# Altium project MIXR Input and Processing.PrjPcb (part 1 of 6)
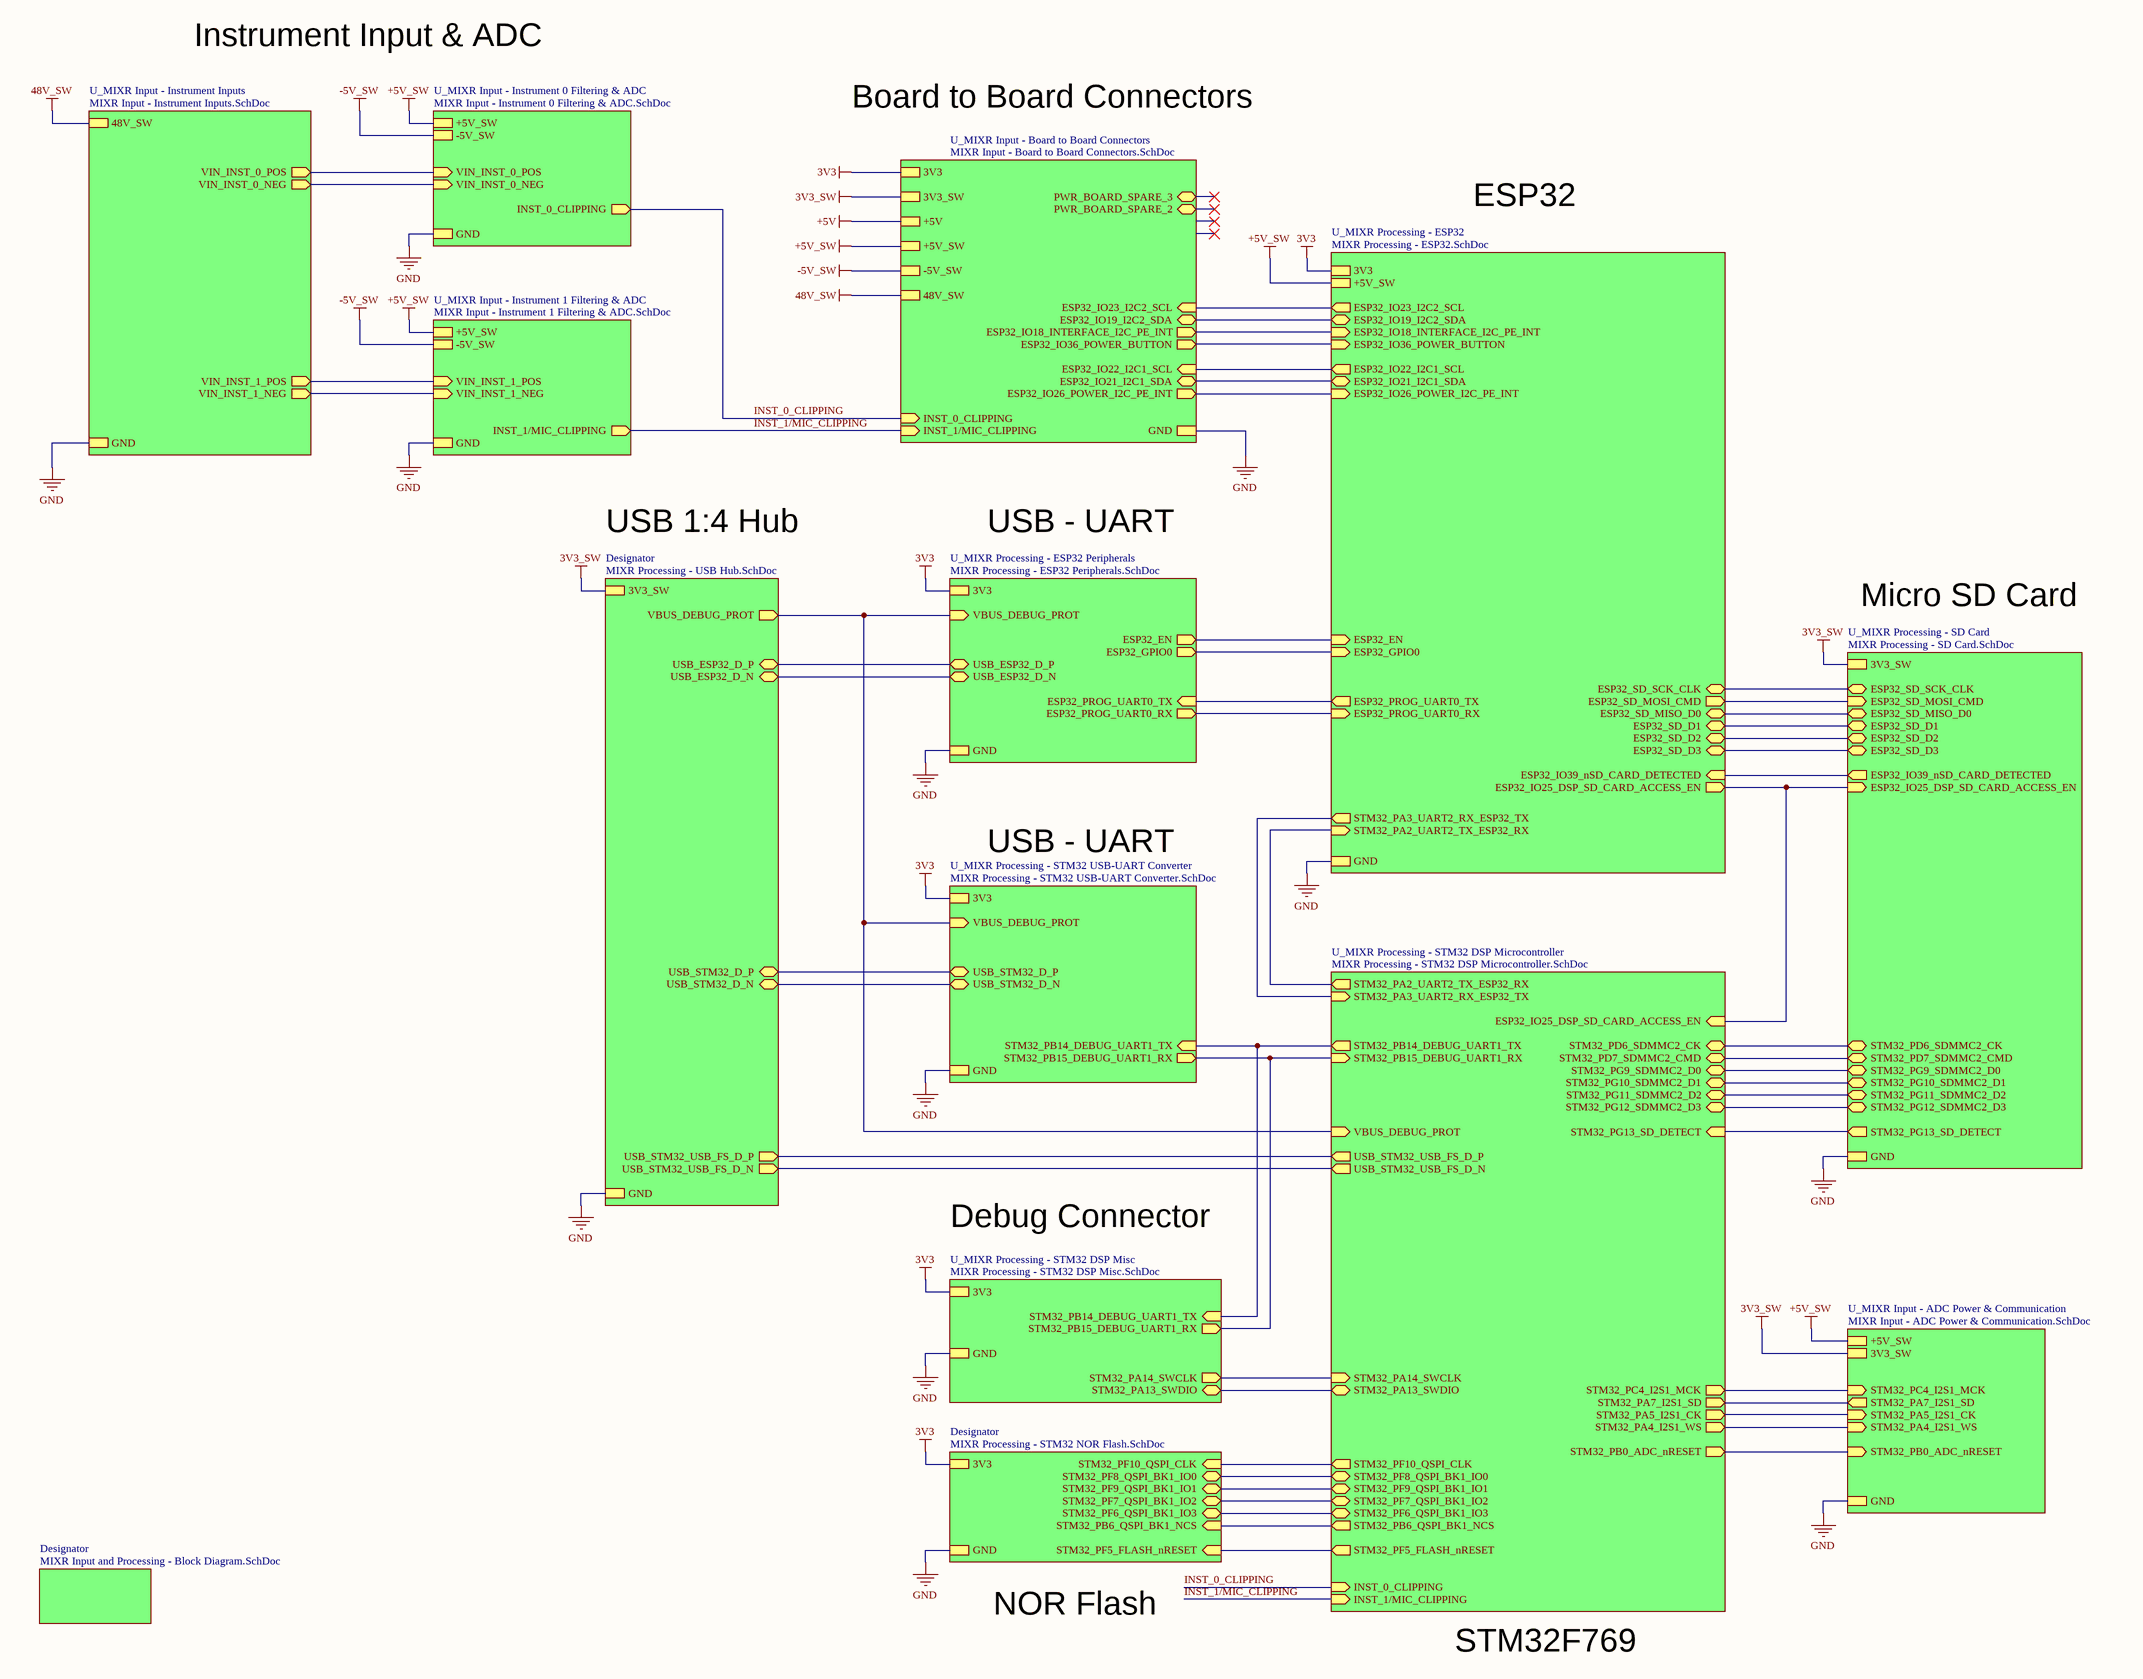
[diagram p0: Top Sheet.SchDoc]
PartNumber: MIXR-002-01; ProjectAuthor: Taiping Li; ProjectRevision: 1.0
15 sheets, 229 parts. Net scope: flat (ports and power ports of the same name join across sheets).
Board file: MIXR Input and Processing.PcbDoc
Sheets:
  Top Sheet.SchDoc
    Designator = MIXR Processing - USB Hub.SchDoc
    U_MIXR Processing - STM32 USB-UART Converter = MIXR Processing - STM32 USB-UART Converter.SchDoc
    U_MIXR Processing - STM32 DSP Microcontroller = MIXR Processing - STM32 DSP Microcontroller.SchDoc
    U_MIXR Processing - SD Card = MIXR Processing - SD Card.SchDoc
    U_MIXR Processing - ESP32 = MIXR Processing - ESP32.SchDoc
    U_MIXR Processing - ESP32 Peripherals = MIXR Processing - ESP32 Peripherals.SchDoc
    U_MIXR Input - Instrument Inputs = MIXR Input - Instrument Inputs.SchDoc
    U_MIXR Input - Instrument 1 Filtering & ADC = MIXR Input - Instrument 1 Filtering & ADC.SchDoc
    U_MIXR Input - Instrument 0 Filtering & ADC = MIXR Input - Instrument 0 Filtering & ADC.SchDoc
    U_MIXR Input - ADC Power & Communication = MIXR Input - ADC Power & Communication.SchDoc
    U_MIXR Processing - STM32 DSP Misc = MIXR Processing - STM32 DSP Misc.SchDoc
    U_MIXR Input - Board to Board Connectors = MIXR Input - Board to Board Connectors.SchDoc
    Designator = MIXR Processing - STM32 NOR Flash.SchDoc
    Designator = MIXR Input and Processing - Block Diagram.SchDoc

## Sheet Top Sheet.SchDoc: MIXR Input & Processing - Top Sheet
size C; Organization: Midnight Sun Solar Rayce Car Team; Address1: University of Waterloo; Address2: 200 University Ave W; Address3: Waterloo, ON, Canada; Address4: N2L 3E9; DocumentNumber: 2; SheetNumber: 2; SheetTotal: 15; Website: www.uwmidsun.com; ProjectName: ProjectName

### Sub-sheets
Designator = MIXR Processing - USB Hub.SchDoc: USB_STM32_D_P (bidir), USB_STM32_D_N (bidir), USB_ESP32_D_N (bidir), USB_STM32_USB_FS_D_N (out), USB_STM32_USB_FS_D_P (out), USB_ESP32_D_P (bidir), GND, VBUS_DEBUG_PROT (out), 3V3_SW
Designator = MIXR Processing - STM32 NOR Flash.SchDoc: STM32_PF6_QSPI_BK1_IO3 (bidir), STM32_PF7_QSPI_BK1_IO2 (bidir), GND, STM32_PF5_FLASH_nRESET (in), STM32_PF10_QSPI_CLK (in), 3V3, STM32_PF8_QSPI_BK1_IO0 (bidir), STM32_PF9_QSPI_BK1_IO1 (bidir), STM32_PB6_QSPI_BK1_NCS (in)
Designator = MIXR Input and Processing - Block Diagram.SchDoc: no entries
U_MIXR Input - ADC Power & Communication = MIXR Input - ADC Power & Communication.SchDoc: STM32_PC4_I2S1_MCK (in), STM32_PA7_I2S1_SD (out), STM32_PA5_I2S1_CK (in), STM32_PA4_I2S1_WS (in), +5V_SW, 3V3_SW, GND, STM32_PB0_ADC_nRESET (in)  | Name: ADC
U_MIXR Input - Board to Board Connectors = MIXR Input - Board to Board Connectors.SchDoc: GND, ESP32_IO21_I2C1_SDA (bidir), 3V3, +5V, -5V_SW, 3V3_SW, +5V_SW, 48V_SW, PWR_BOARD_SPARE_2 (bidir), PWR_BOARD_SPARE_3 (bidir), ESP32_IO22_I2C1_SCL (in), ESP32_IO26_POWER_I2C_PE_INT (out), ESP32_IO19_I2C2_SDA (bidir), ESP32_IO18_INTERFACE_I2C_PE_INT (out), ESP32_IO36_POWER_BUTTON (out), ESP32_IO23_I2C2_SCL (in), INST_1/MIC_CLIPPING (in), INST_0_CLIPPING (in)  | Name: PWR BOARD
U_MIXR Input - Instrument 0 Filtering & ADC = MIXR Input - Instrument 0 Filtering & ADC.SchDoc: VIN_INST_0_POS (in), VIN_INST_0_NEG (in), INST_0_CLIPPING (out), GND, -5V_SW, +5V_SW
U_MIXR Input - Instrument 1 Filtering & ADC = MIXR Input - Instrument 1 Filtering & ADC.SchDoc: VIN_INST_1_POS (in), VIN_INST_1_NEG (in), INST_1/MIC_CLIPPING (out), GND, -5V_SW, +5V_SW
U_MIXR Input - Instrument Inputs = MIXR Input - Instrument Inputs.SchDoc: VIN_INST_0_POS (out), VIN_INST_0_NEG (out), VIN_INST_1_POS (out), VIN_INST_1_NEG (out), 48V_SW, GND
U_MIXR Processing - ESP32 = MIXR Processing - ESP32.SchDoc: ESP32_SD_SCK_CLK (bidir), ESP32_SD_MOSI_CMD (out), ESP32_SD_MISO_D0 (bidir), ESP32_SD_D1 (bidir), ESP32_SD_D3 (bidir), ESP32_EN (in), ESP32_GPIO0 (in), ESP32_PROG_UART0_TX (out), ESP32_PROG_UART0_RX (in), ESP32_IO19_I2C2_SDA (bidir), ESP32_IO23_I2C2_SCL (out), ESP32_IO39_nSD_CARD_DETECTED (in), ESP32_IO36_POWER_BUTTON (in), ESP32_IO25_DSP_SD_CARD_ACCESS_EN (out), ESP32_IO21_I2C1_SDA (bidir), ESP32_IO22_I2C1_SCL (out), ESP32_SD_D2 (bidir), ESP32_IO26_POWER_I2C_PE_INT (in), 3V3, GND, STM32_PA2_UART2_TX_ESP32_RX (in), STM32_PA3_UART2_RX_ESP32_TX (out), ESP32_IO18_INTERFACE_I2C_PE_INT (in), +5V_SW  | Name: ESP32
U_MIXR Processing - ESP32 Peripherals = MIXR Processing - ESP32 Peripherals.SchDoc: USB_ESP32_D_P (bidir), USB_ESP32_D_N (bidir), ESP32_EN (out), ESP32_GPIO0 (out), ESP32_PROG_UART0_TX (in), ESP32_PROG_UART0_RX (out), 3V3, GND, VBUS_DEBUG_PROT (in)
U_MIXR Processing - SD Card = MIXR Processing - SD Card.SchDoc: ESP32_SD_SCK_CLK (bidir), ESP32_SD_MOSI_CMD (in), ESP32_SD_MISO_D0 (bidir), ESP32_SD_D1 (bidir), ESP32_SD_D2 (bidir), ESP32_SD_D3 (bidir), ESP32_IO39_nSD_CARD_DETECTED (out), STM32_PG11_SDMMC2_D2 (bidir), STM32_PG12_SDMMC2_D3 (bidir), STM32_PD6_SDMMC2_CK (bidir), STM32_PD7_SDMMC2_CMD (bidir), STM32_PG13_SD_DETECT (out), STM32_PG10_SDMMC2_D1 (bidir), STM32_PG9_SDMMC2_D0 (bidir), GND, 3V3_SW, ESP32_IO25_DSP_SD_CARD_ACCESS_EN (in)  | Name: SD Card
U_MIXR Processing - STM32 DSP Microcontroller = MIXR Processing - STM32 DSP Microcontroller.SchDoc: STM32_PG11_SDMMC2_D2 (bidir), STM32_PG12_SDMMC2_D3 (bidir), STM32_PG10_SDMMC2_D1 (bidir), STM32_PG9_SDMMC2_D0 (bidir), STM32_PD6_SDMMC2_CK (bidir), STM32_PD7_SDMMC2_CMD (bidir), STM32_PC4_I2S1_MCK (out), STM32_PA7_I2S1_SD (out), STM32_PA5_I2S1_CK (out), STM32_PA4_I2S1_WS (out), STM32_PB14_DEBUG_UART1_TX (out), STM32_PB15_DEBUG_UART1_RX (in), USB_STM32_USB_FS_D_P (out), USB_STM32_USB_FS_D_N (out), STM32_PG13_SD_DETECT (in), STM32_PA14_SWCLK (in), STM32_PA13_SWDIO (bidir), VBUS_DEBUG_PROT (in), STM32_PB0_ADC_nRESET (out), STM32_PA2_UART2_TX_ESP32_RX (out), STM32_PA3_UART2_RX_ESP32_TX (in), ESP32_IO25_DSP_SD_CARD_ACCESS_EN (in), INST_0_CLIPPING (in), INST_1/MIC_CLIPPING (in), STM32_PF7_QSPI_BK1_IO2 (bidir), STM32_PF8_QSPI_BK1_IO0 (bidir), STM32_PF6_QSPI_BK1_IO3 (bidir), STM32_PF9_QSPI_BK1_IO1 (bidir), STM32_PF10_QSPI_CLK (out), STM32_PB6_QSPI_BK1_NCS (out), STM32_PF5_FLASH_nRESET (out)
U_MIXR Processing - STM32 DSP Misc = MIXR Processing - STM32 DSP Misc.SchDoc: 3V3, STM32_PA13_SWDIO (bidir), STM32_PA14_SWCLK (out), STM32_PB15_DEBUG_UART1_RX (out), STM32_PB14_DEBUG_UART1_TX (in), GND
U_MIXR Processing - STM32 USB-UART Converter = MIXR Processing - STM32 USB-UART Converter.SchDoc: USB_STM32_D_P (bidir), USB_STM32_D_N (bidir), STM32_PB14_DEBUG_UART1_TX (in), STM32_PB15_DEBUG_UART1_RX (out), 3V3, GND, VBUS_DEBUG_PROT (in)

### Nets
3V3: sheet U_MIXR Processing - STM32 USB-UART Converter/3V3, sheet U_MIXR Processing - ESP32/3V3, sheet U_MIXR Processing - ESP32 Peripherals/3V3, sheet U_MIXR Processing - STM32 DSP Misc/3V3, sheet U_MIXR Input - Board to Board Connectors/3V3, sheet Designator/3V3
3V3_SW: sheet Designator/3V3_SW, sheet U_MIXR Processing - SD Card/3V3_SW, sheet U_MIXR Input - ADC Power & Communication/3V3_SW, sheet U_MIXR Input - Board to Board Connectors/3V3_SW
48V_SW: sheet U_MIXR Input - Instrument Inputs/48V_SW, sheet U_MIXR Input - Board to Board Connectors/48V_SW
+5V_SW: sheet U_MIXR Processing - ESP32/+5V_SW, sheet U_MIXR Input - Instrument 1 Filtering & ADC/+5V_SW, sheet U_MIXR Input - Instrument 0 Filtering & ADC/+5V_SW, sheet U_MIXR Input - ADC Power & Communication/+5V_SW, sheet U_MIXR Input - Board to Board Connectors/+5V_SW
-5V_SW: sheet U_MIXR Input - Instrument 1 Filtering & ADC/-5V_SW, sheet U_MIXR Input - Instrument 0 Filtering & ADC/-5V_SW, sheet U_MIXR Input - Board to Board Connectors/-5V_SW
GND: sheet Designator/GND, sheet U_MIXR Processing - STM32 USB-UART Converter/GND, sheet U_MIXR Processing - SD Card/GND, sheet U_MIXR Processing - ESP32/GND, sheet U_MIXR Processing - ESP32 Peripherals/GND, sheet U_MIXR Input - Instrument Inputs/GND, sheet U_MIXR Input - Instrument 1 Filtering & ADC/GND, sheet U_MIXR Input - Instrument 0 Filtering & ADC/GND, sheet U_MIXR Input - ADC Power & Communication/GND, sheet U_MIXR Processing - STM32 DSP Misc/GND, sheet U_MIXR Input - Board to Board Connectors/GND, sheet Designator/GND
INST_0_CLIPPING: sheet U_MIXR Processing - STM32 DSP Microcontroller/INST_0_CLIPPING, sheet U_MIXR Input - Instrument 0 Filtering & ADC/INST_0_CLIPPING, sheet U_MIXR Input - Board to Board Connectors/INST_0_CLIPPING
INST_1/MIC_CLIPPING: sheet U_MIXR Processing - STM32 DSP Microcontroller/INST_1/MIC_CLIPPING, sheet U_MIXR Input - Instrument 1 Filtering & ADC/INST_1/MIC_CLIPPING, sheet U_MIXR Input - Board to Board Connectors/INST_1/MIC_CLIPPING
(unnamed): sheet Designator/USB_STM32_D_P, sheet U_MIXR Processing - STM32 USB-UART Converter/USB_STM32_D_P
(unnamed): sheet Designator/USB_STM32_D_N, sheet U_MIXR Processing - STM32 USB-UART Converter/USB_STM32_D_N
(unnamed): sheet Designator/USB_ESP32_D_N, sheet U_MIXR Processing - ESP32 Peripherals/USB_ESP32_D_N
(unnamed): sheet Designator/USB_STM32_USB_FS_D_N, sheet U_MIXR Processing - STM32 DSP Microcontroller/USB_STM32_USB_FS_D_N
(unnamed): sheet Designator/USB_STM32_USB_FS_D_P, sheet U_MIXR Processing - STM32 DSP Microcontroller/USB_STM32_USB_FS_D_P
(unnamed): sheet Designator/USB_ESP32_D_P, sheet U_MIXR Processing - ESP32 Peripherals/USB_ESP32_D_P
(unnamed): sheet Designator/VBUS_DEBUG_PROT, sheet U_MIXR Processing - STM32 USB-UART Converter/VBUS_DEBUG_PROT, sheet U_MIXR Processing - STM32 DSP Microcontroller/VBUS_DEBUG_PROT, sheet U_MIXR Processing - ESP32 Peripherals/VBUS_DEBUG_PROT
(unnamed): sheet U_MIXR Processing - STM32 USB-UART Converter/STM32_PB14_DEBUG_UART1_TX, sheet U_MIXR Processing - STM32 DSP Microcontroller/STM32_PB14_DEBUG_UART1_TX, sheet U_MIXR Processing - STM32 DSP Misc/STM32_PB14_DEBUG_UART1_TX
(unnamed): sheet U_MIXR Processing - STM32 USB-UART Converter/STM32_PB15_DEBUG_UART1_RX, sheet U_MIXR Processing - STM32 DSP Microcontroller/STM32_PB15_DEBUG_UART1_RX, sheet U_MIXR Processing - STM32 DSP Misc/STM32_PB15_DEBUG_UART1_RX
(unnamed): sheet U_MIXR Processing - STM32 DSP Microcontroller/STM32_PG11_SDMMC2_D2, sheet U_MIXR Processing - SD Card/STM32_PG11_SDMMC2_D2
(unnamed): sheet U_MIXR Processing - STM32 DSP Microcontroller/STM32_PG12_SDMMC2_D3, sheet U_MIXR Processing - SD Card/STM32_PG12_SDMMC2_D3
(unnamed): sheet U_MIXR Processing - STM32 DSP Microcontroller/STM32_PG10_SDMMC2_D1, sheet U_MIXR Processing - SD Card/STM32_PG10_SDMMC2_D1
(unnamed): sheet U_MIXR Processing - STM32 DSP Microcontroller/STM32_PG9_SDMMC2_D0, sheet U_MIXR Processing - SD Card/STM32_PG9_SDMMC2_D0
(unnamed): sheet U_MIXR Processing - STM32 DSP Microcontroller/STM32_PD6_SDMMC2_CK, sheet U_MIXR Processing - SD Card/STM32_PD6_SDMMC2_CK
(unnamed): sheet U_MIXR Processing - STM32 DSP Microcontroller/STM32_PD7_SDMMC2_CMD, sheet U_MIXR Processing - SD Card/STM32_PD7_SDMMC2_CMD
(unnamed): sheet U_MIXR Processing - STM32 DSP Microcontroller/STM32_PC4_I2S1_MCK, sheet U_MIXR Input - ADC Power & Communication/STM32_PC4_I2S1_MCK
(unnamed): sheet U_MIXR Processing - STM32 DSP Microcontroller/STM32_PA7_I2S1_SD, sheet U_MIXR Input - ADC Power & Communication/STM32_PA7_I2S1_SD
(unnamed): sheet U_MIXR Processing - STM32 DSP Microcontroller/STM32_PA5_I2S1_CK, sheet U_MIXR Input - ADC Power & Communication/STM32_PA5_I2S1_CK
(unnamed): sheet U_MIXR Processing - STM32 DSP Microcontroller/STM32_PA4_I2S1_WS, sheet U_MIXR Input - ADC Power & Communication/STM32_PA4_I2S1_WS
(unnamed): sheet U_MIXR Processing - STM32 DSP Microcontroller/STM32_PG13_SD_DETECT, sheet U_MIXR Processing - SD Card/STM32_PG13_SD_DETECT
(unnamed): sheet U_MIXR Processing - STM32 DSP Microcontroller/STM32_PA14_SWCLK, sheet U_MIXR Processing - STM32 DSP Misc/STM32_PA14_SWCLK
(unnamed): sheet U_MIXR Processing - STM32 DSP Microcontroller/STM32_PA13_SWDIO, sheet U_MIXR Processing - STM32 DSP Misc/STM32_PA13_SWDIO
(unnamed): sheet U_MIXR Processing - STM32 DSP Microcontroller/STM32_PB0_ADC_nRESET, sheet U_MIXR Input - ADC Power & Communication/STM32_PB0_ADC_nRESET
(unnamed): sheet U_MIXR Processing - STM32 DSP Microcontroller/STM32_PA2_UART2_TX_ESP32_RX, sheet U_MIXR Processing - ESP32/STM32_PA2_UART2_TX_ESP32_RX
(unnamed): sheet U_MIXR Processing - STM32 DSP Microcontroller/STM32_PA3_UART2_RX_ESP32_TX, sheet U_MIXR Processing - ESP32/STM32_PA3_UART2_RX_ESP32_TX
(unnamed): sheet U_MIXR Processing - STM32 DSP Microcontroller/ESP32_IO25_DSP_SD_CARD_ACCESS_EN, sheet U_MIXR Processing - SD Card/ESP32_IO25_DSP_SD_CARD_ACCESS_EN, sheet U_MIXR Processing - ESP32/ESP32_IO25_DSP_SD_CARD_ACCESS_EN
(unnamed): sheet U_MIXR Processing - STM32 DSP Microcontroller/STM32_PF7_QSPI_BK1_IO2, sheet Designator/STM32_PF7_QSPI_BK1_IO2
(unnamed): sheet U_MIXR Processing - STM32 DSP Microcontroller/STM32_PF8_QSPI_BK1_IO0, sheet Designator/STM32_PF8_QSPI_BK1_IO0
(unnamed): sheet U_MIXR Processing - STM32 DSP Microcontroller/STM32_PF6_QSPI_BK1_IO3, sheet Designator/STM32_PF6_QSPI_BK1_IO3
(unnamed): sheet U_MIXR Processing - STM32 DSP Microcontroller/STM32_PF9_QSPI_BK1_IO1, sheet Designator/STM32_PF9_QSPI_BK1_IO1
(unnamed): sheet U_MIXR Processing - STM32 DSP Microcontroller/STM32_PF10_QSPI_CLK, sheet Designator/STM32_PF10_QSPI_CLK
(unnamed): sheet U_MIXR Processing - STM32 DSP Microcontroller/STM32_PB6_QSPI_BK1_NCS, sheet Designator/STM32_PB6_QSPI_BK1_NCS
(unnamed): sheet U_MIXR Processing - STM32 DSP Microcontroller/STM32_PF5_FLASH_nRESET, sheet Designator/STM32_PF5_FLASH_nRESET
(unnamed): sheet U_MIXR Processing - SD Card/ESP32_SD_SCK_CLK, sheet U_MIXR Processing - ESP32/ESP32_SD_SCK_CLK
(unnamed): sheet U_MIXR Processing - SD Card/ESP32_SD_MOSI_CMD, sheet U_MIXR Processing - ESP32/ESP32_SD_MOSI_CMD
(unnamed): sheet U_MIXR Processing - SD Card/ESP32_SD_MISO_D0, sheet U_MIXR Processing - ESP32/ESP32_SD_MISO_D0
(unnamed): sheet U_MIXR Processing - SD Card/ESP32_SD_D1, sheet U_MIXR Processing - ESP32/ESP32_SD_D1
(unnamed): sheet U_MIXR Processing - SD Card/ESP32_SD_D2, sheet U_MIXR Processing - ESP32/ESP32_SD_D2
(unnamed): sheet U_MIXR Processing - SD Card/ESP32_SD_D3, sheet U_MIXR Processing - ESP32/ESP32_SD_D3
(unnamed): sheet U_MIXR Processing - SD Card/ESP32_IO39_nSD_CARD_DETECTED, sheet U_MIXR Processing - ESP32/ESP32_IO39_nSD_CARD_DETECTED
(unnamed): sheet U_MIXR Processing - ESP32/ESP32_EN, sheet U_MIXR Processing - ESP32 Peripherals/ESP32_EN
(unnamed): sheet U_MIXR Processing - ESP32/ESP32_GPIO0, sheet U_MIXR Processing - ESP32 Peripherals/ESP32_GPIO0
(unnamed): sheet U_MIXR Processing - ESP32/ESP32_PROG_UART0_TX, sheet U_MIXR Processing - ESP32 Peripherals/ESP32_PROG_UART0_TX
(unnamed): sheet U_MIXR Processing - ESP32/ESP32_PROG_UART0_RX, sheet U_MIXR Processing - ESP32 Peripherals/ESP32_PROG_UART0_RX
(unnamed): sheet U_MIXR Processing - ESP32/ESP32_IO19_I2C2_SDA, sheet U_MIXR Input - Board to Board Connectors/ESP32_IO19_I2C2_SDA
(unnamed): sheet U_MIXR Processing - ESP32/ESP32_IO23_I2C2_SCL, sheet U_MIXR Input - Board to Board Connectors/ESP32_IO23_I2C2_SCL
(unnamed): sheet U_MIXR Processing - ESP32/ESP32_IO36_POWER_BUTTON, sheet U_MIXR Input - Board to Board Connectors/ESP32_IO36_POWER_BUTTON
(unnamed): sheet U_MIXR Processing - ESP32/ESP32_IO21_I2C1_SDA, sheet U_MIXR Input - Board to Board Connectors/ESP32_IO21_I2C1_SDA
(unnamed): sheet U_MIXR Processing - ESP32/ESP32_IO22_I2C1_SCL, sheet U_MIXR Input - Board to Board Connectors/ESP32_IO22_I2C1_SCL
(unnamed): sheet U_MIXR Processing - ESP32/ESP32_IO26_POWER_I2C_PE_INT, sheet U_MIXR Input - Board to Board Connectors/ESP32_IO26_POWER_I2C_PE_INT
(unnamed): sheet U_MIXR Processing - ESP32/ESP32_IO18_INTERFACE_I2C_PE_INT, sheet U_MIXR Input - Board to Board Connectors/ESP32_IO18_INTERFACE_I2C_PE_INT
(unnamed): sheet U_MIXR Input - Instrument Inputs/VIN_INST_0_POS, sheet U_MIXR Input - Instrument 0 Filtering & ADC/VIN_INST_0_POS
(unnamed): sheet U_MIXR Input - Instrument Inputs/VIN_INST_0_NEG, sheet U_MIXR Input - Instrument 0 Filtering & ADC/VIN_INST_0_NEG
(unnamed): sheet U_MIXR Input - Instrument Inputs/VIN_INST_1_POS, sheet U_MIXR Input - Instrument 1 Filtering & ADC/VIN_INST_1_POS
(unnamed): sheet U_MIXR Input - Instrument Inputs/VIN_INST_1_NEG, sheet U_MIXR Input - Instrument 1 Filtering & ADC/VIN_INST_1_NEG

### Notes on the sheet
- Instrument Input & ADC
- Board to Board Connectors
- ESP32
- USB 1:4 Hub
- USB - UART
- Micro SD Card
- Debug Connector
- NOR Flash
- STM32F769
- PROJECT
- DOCUMENT
- PART NUMBER
- VARIANT
- DRAWN BY
- LAST MODIFIED
- REVISION
- SHEET
- OF

## Sheet MIXR Processing - USB Hub.SchDoc: USB Hub
size B; Organization: Midnight Sun Solar Rayce Car Team; Address1: University of Waterloo; Address2: 200 University Ave W; Address3: Waterloo, ON, Canada; Address4: N2L 3E9; DocumentNumber: 14; SheetNumber: 14; SheetTotal: 15; Website: www.uwmidsun.com; ProjectName: ProjectName
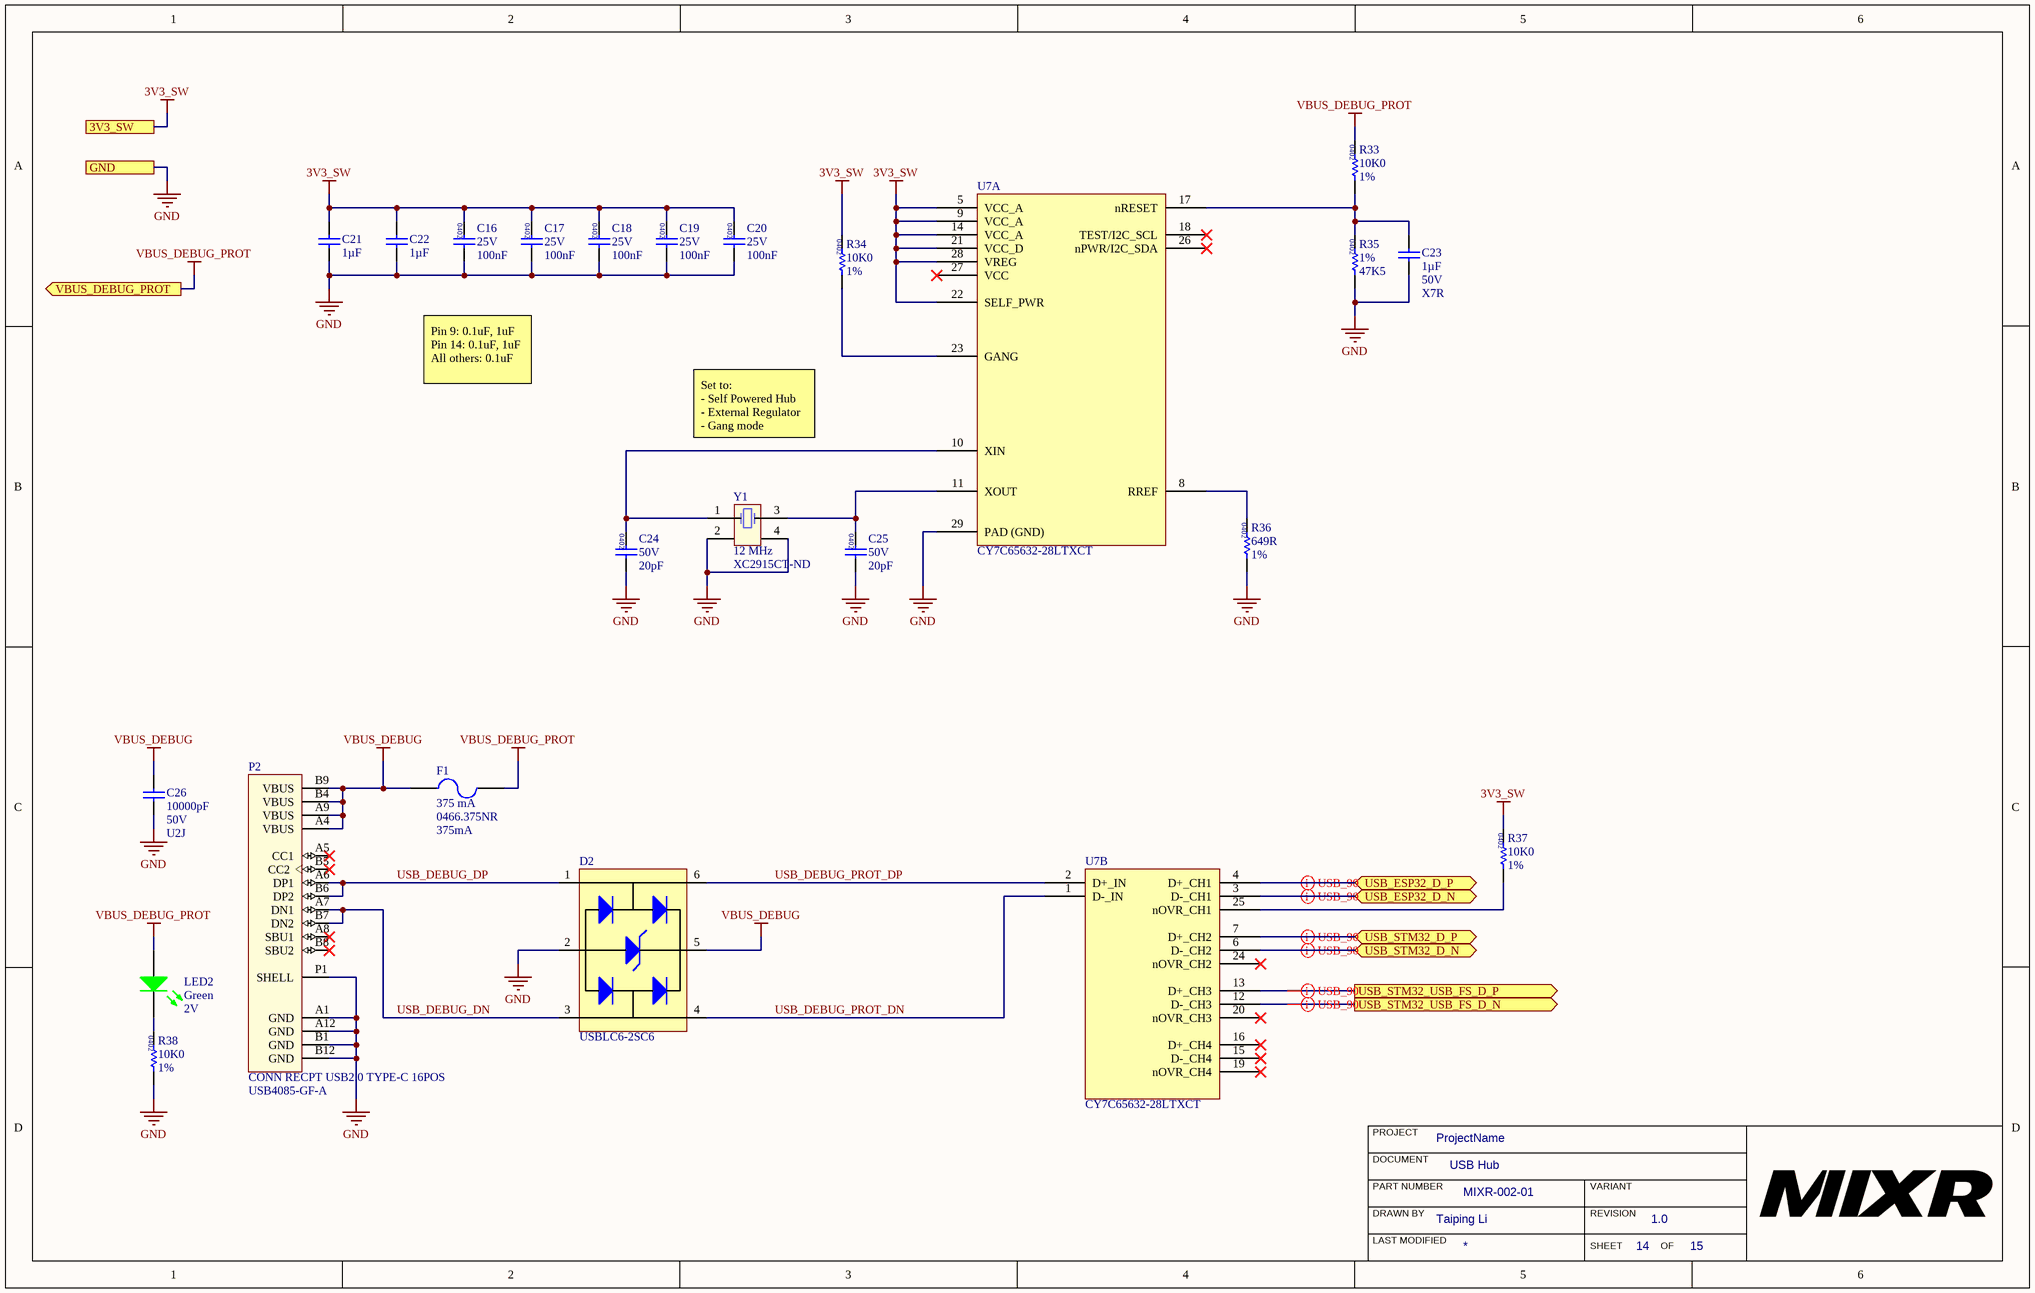
[diagram p1: MIXR Processing - USB Hub.SchDoc]

### Parts
C16  Voltage: 25V  Capacitance: 100nF  [CAP 0402]  (hidden comment: CAP CER 0.1UF 16V X7R 0402)
C17  Voltage: 25V  Capacitance: 100nF  [CAP 0402]  (hidden comment: CAP CER 0.1UF 16V X7R 0402)
C18  Voltage: 25V  Capacitance: 100nF  [CAP 0402]  (hidden comment: CAP CER 0.1UF 16V X7R 0402)
C19  Voltage: 25V  Capacitance: 100nF  [CAP 0402]  (hidden comment: CAP CER 0.1UF 16V X7R 0402)
C20  Voltage: 25V  Capacitance: 100nF  [CAP 0402]  (hidden comment: CAP CER 0.1UF 16V X7R 0402)
C21  Capacitance: 1µF  [CAP, 0603]  (hidden comment: CAP CER 1UF 50V 10% X7R 0603)
C22  Capacitance: 1µF  [CAP, 0603]  (hidden comment: CAP CER 1UF 50V 10% X7R 0603)
C23  Capacitance: 1µF  Voltage: 50V  Temperature Coefficient: X7R  [CAP, 0603]  (hidden comment: CAP CER 1UF 50V 10% X7R 0603)
C24  Voltage Rating: 50V  Capacitance: 20pF  [CAP 0402]  (hidden comment: CAP CER 20PF 50V C0G/NPO 0402)
C25  Voltage Rating: 50V  Capacitance: 20pF  [CAP 0402]  (hidden comment: CAP CER 20PF 50V C0G/NPO 0402)
C26  Capacitance: 10000pF  Voltage: 50V  Temperature Coefficient: U2J  [CAP, 0603]  (hidden comment: CAP CER 10nF 50V 5% X7R 0603)
D2  Manufacturer Part Number 1: USBLC6-2SC6  [SOT23-6]  (hidden comment: DIODE TVS 5.25V 17V SOT23-6)
F1  375 mA  Manufacturer Part Number: 0466.375NR  Current Rating: 375mA  [FUSE LITTLEFUSE 0466 1206]
LED2  Color: Green  Voltage - Forward (Vf) (Typ): 2V  [LED_0603]  (hidden comment: LED GREEN CLEAR 2V 0603)
P2  CONN RECPT USB2.0 TYPE-C 16POS  Manufacturer Part Number: USB4085-GF-A  [CONN RECPT USB2.0 TYPE C 16-POS]
R33  Resistance: 10K0  Tolerance: 1%  [RES 0402]  (hidden comment: RES 10K OHM 1% 1/16W 0402)
R34  Resistance: 10K0  Tolerance: 1%  [RES 0402]  (hidden comment: RES 10K OHM 1% 1/16W 0402)
R35  Tolerance: 1%  Resistance: 47K5  [RES 0402]  (hidden comment: RES 47.5K OHM 1% 1/16W 0402)
R36  Resistance: 649R  Tolerance: 1%  [RES 0402]  (hidden comment: RES 649 OHM 1% 1/16W 0402)
R37  Resistance: 10K0  Tolerance: 1%  [RES 0402]  (hidden comment: RES 10K OHM 1% 1/16W 0402)
R38  Resistance: 10K0  Tolerance: 1%  [RES 0402]  (hidden comment: RES 10K OHM 1% 1/16W 0402)
U7  Manufacturer Part Number: CY7C65632-28LTXCT  [QFN50P500X500X80-29N]  (hidden comment: IC USB 2.0 HUB CONTROLLER 28QFN)  (parts A,B of 2)
Y1  12 MHz  Supplier Part Number 1: XC2915CT-ND  [CRYSTAL ECX-32]

### Ports
3V3_SW, GND, USB_ESP32_D_N (bidir), USB_ESP32_D_P (bidir), USB_STM32_D_N (bidir), USB_STM32_D_P (bidir), USB_STM32_USB_FS_D_N (out), USB_STM32_USB_FS_D_P (out), VBUS_DEBUG_PROT (out)

### Nets
3V3_SW: C16.1 C17.1 C18.1 C19.1 C20.1 C21.1 C22.1 R34.1 R37.1 U7.5(VCC_A) U7.9(VCC_A) U7.14(VCC_A) U7.21(VCC_D) U7.22(SELF_PWR) U7.28(VREG) ; port 3V3_SW
GND: C16.2 C17.2 C18.2 C19.2 C20.2 C21.2 C22.2 C23.2 C24.2 C25.2 C26.2 D2.2(Cathode2) P2.A1(GND) P2.A12(GND) P2.B1(GND) P2.B12(GND) P2.P1(SHELL) R35.2 R36.2 R38.2 U7.29(PAD_(GND)) Y1.2 Y1.4 ; port GND
VBUS_DEBUG: C26.1 D2.5(Cathode4) F1.1 P2.A4(VBUS) P2.A9(VBUS) P2.B4(VBUS) P2.B9(VBUS)
VBUS_DEBUG_PROT: F1.2 LED2.1(A) R33.1 ; port VBUS_DEBUG_PROT
USB_DEBUG_DN: D2.3(Cathode1) P2.A7(DN1) P2.B7(DN2)
USB_DEBUG_DP: D2.1(Cathode3) P2.A6(DP1) P2.B6(DP2)
USB_DEBUG_PROT_DN: D2.4(Cathode2) U7.1(D-_IN)
USB_DEBUG_PROT_DP: D2.6(Cathode3) U7.2(D+_IN)
USB_ESP32_D_N: U7.3(D-_CH1) ; port USB_ESP32_D_N
USB_ESP32_D_P: U7.4(D+_CH1) ; port USB_ESP32_D_P
USB_STM32_D_N: U7.6(D-_CH2) ; port USB_STM32_D_N
USB_STM32_D_P: U7.7(D+_CH2) ; port USB_STM32_D_P
USB_STM32_USB_FS_D_N: U7.12(D-_CH3) ; port USB_STM32_USB_FS_D_N
USB_STM32_USB_FS_D_P: U7.13(D+_CH3) ; port USB_STM32_USB_FS_D_P
NetC23_1: C23.1 R33.2 R35.1 U7.17(nRESET)
NetC24_1: C24.1 U7.10(XIN) Y1.1(OSC1)
NetC25_1: C25.1 U7.11(XOUT) Y1.3(OSC2)
NetLED2_2: LED2.2(K) R38.1
NetR34_2: R34.2 U7.23(GANG)
NetR36_1: R36.1 U7.8(RREF)
NetR37_2: R37.2 U7.25(nOVR_CH1)

Not connected (* = marked no-connect by the designer): P2 A5(CC1)* A8(SBU1)* B5(CC2)* B8(SBU2)*; U7 15(D-_CH4)* 16(D+_CH4)* 18(TEST/I2C_SCL)* 19(nOVR_CH4)* 20(nOVR_CH3)* 24(nOVR_CH2)* 26(nPWR/I2C_SDA)* 27(VCC)*

### Layout directives
differential pair: USB_ESP32_D_N, USB_ESP32_D_P, USB_STM32_D_N, USB_STM32_D_P, USB_STM32_USB_FS_D_N, USB_STM32_USB_FS_D_P

### Notes on the sheet
- Pin 9: 0.1uF, 1uF
  Pin 14: 0.1uF, 1uF
  All others: 0.1uF
- Set to:
  - Self Powered Hub
  - External Regulator
  - Gang mode
- PROJECT
- DOCUMENT
- DRAWN BY
- LAST MODIFIED
- PART NUMBER
- REVISION
- SHEET
- VARIANT
- OF

### Library data of the parts
C16-C20 = CAP CER 0.1UF 16V X7R 0402: Cap Ceramic 0.1uF 25V X7R 10% SMD 0402 125C Paper T/R; Manufacturer: Murata; Manufacturer Part Number: GRM155R71E104KE14D; Supplier 1: Digi-Key; RoHS: Yes; Category: Ceramic Capacitors; Stock 1: 785540; Pricing 1: 1=0.10000, 10=0.03400, 100=0.01520, 500=0.01088, 1000=0.00855, 2500=0.00778, 5000=0.00715 (USD); Mount: Surface Mount; Case/Package: 0402; Weight: 0.000212oz; Case Code (Metric): 1005; Case Code (Imperial): 0402; Dielectric Material: Ceramic; Min Operating Temperature: -55°C; Max Operating Temperature: 125°C; Packaging: Tape and Reel; Tolerance: 10%; Termination: SMD/SMT; Composition: Ceramic; Package Quantity: 10000; Length: 1mm; Height: 0.5mm; Width: 0.02inch; Thickness: 0.022inch; Depth: 0.5mm; REACH SVHC: Unknown; Lead Free: Lead Free; ComponentLink1URL: http://www.farnell.com/datasheets/2048008.pdf?src-supplier=Farnell; ComponentLink1Description: http://www.farnell.com/datasheets/2048008.pdf?src-supplier=Farnell; ComponentLink2URL: http://uk.rs-online.com/webdocs/144c/0900766b8144c113.pdf?src-supplier=RSComponents; ComponentLink2Description: http://uk.rs-online.com/webdocs/144c/0900766b8144c113.pdf?src-supplier=RSComponents; ComponentLink3URL: http://www.farnell.com/datasheets/1872206.pdf?src-supplier=Farnell; ComponentLink3Description: http://www.farnell.com/datasheets/1872206.pdf?src-supplier=Farnell; ComponentLink4URL: http://components.arrow.com/part/dataview/0323_06361249?src-supplier=Arrow+Europe; ComponentLink4Description: http://components.arrow.com/part/dataview/0323_06361249?src-supplier=Arrow+Europe; ComponentLink5URL: http://www.mouser.com/ds/2/281/c02e-2905.pdf?src-supplier=Mouser; ComponentLink5Description: http://www.mouser.com/ds/2/281/c02e-2905.pdf?src-supplier=Mouser; ComponentLink6URL: http://www.farnell.com/datasheets/2048008.pdf?src-supplier=Newark; ComponentLink6Description: http://www.farnell.com/datasheets/2048008.pdf?src-supplier=Newark; ComponentLink7URL: http://psearch.en.murata.com/capacitor/product/GRM155R71E104KE14%23.pdf?src-supplier=Avnet; ComponentLink7Description: http://psearch.en.murata.com/capacitor/product/GRM155R71E104KE14%23.pdf?src-supplier=Avnet; ComponentLink8URL: https://search.murata.co.jp/Ceramy/image/img/A01X/G101/ENG/GRM155R71E104KE14-01.pdf?src-supplier=Digi-Key; ComponentLink8Description: https://search.murata.co.jp/Ceramy/image/img/A01X/G101/ENG/GRM155R71E104KE14-01.pdf?src-supplier=Digi-Key; ComponentLink9URL: http://www.farnell.com/datasheets/2048008.pdf?src-supplier=Element14; ComponentLink9Description: http://www.farnell.com/datasheets/2048008.pdf?src-supplier=Element14; Supplier Part Number 1: 490-10698-1-ND; Dielectric: X7R; Voltage Rating (DC): 25V; Voltage Rating: 25V
C21-C23 = CAP CER 1UF 50V 10% X7R 0603: 1µF ±10% 50V Ceramic Capacitor X7R 0603 (1608 Metric); Manufacturer 1: Taiyo Yuden; Manufacturer Part Number 1: UMK107AB7105KA-T; Supplier 1: Digi-Key; Supplier Part Number 1: 587-3247-1-ND; Packaging: Cut Tape (CT); Part Status: Active; Operating Temperature: -55°C ~ 125°C; Ratings: -; Mounting Type: Surface Mount, MLCC; Package / Case: 0603 (1608 Metric); Size / Dimension: 0.063" L x 0.031" W (1.60mm x 0.80mm); Height - Seated (Max): -; Thickness (Max): 0.037" (0.95mm); Lead Spacing: -; Lead Style: -; ComponentLink1URL: http://www.yuden.co.jp/productdata/catalog/en/mlcc_all_e.pdf; ComponentLink1Description: http://www.yuden.co.jp/productdata/catalog/en/mlcc_all_e.pdf; Tolerance: ±10%
  C22: Voltage: 50V; Temperature Coefficient: X7R
C24 C25 = CAP CER 20PF 50V C0G/NPO 0402: Cap Ceramic 20pF 50V C0G 5% SMD 0402 125C Paper T/R; Manufacturer: Samsung; Manufacturer Part Number: CL05C200JB5NNNC; Supplier 1: Digi-Key; RoHS: Yes; Category: Ceramic Capacitors; Stock 1: 2241047; Pricing 1: 1=0.10000, 10=0.03300, 100=0.01480, 500=0.01058, 1000=0.00831, 2500=0.00755, 5000=0.00695 (USD); Mount: Surface Mount; Case/Package: 0402; Case Code (Metric): 1005; Case Code (Imperial): 0402; Contact Plating: Tin; Min Operating Temperature: -55°C; Max Operating Temperature: 125°C; Tolerance: 5%; Package Quantity: 1; Packaging: Tape and Reel; Dielectric: C0G; Length: 1mm; Height: 0.5mm; Width: 0.02inch; Thickness: 0.022inch; Depth: 0.5mm; Radiation Hardening: No; ComponentLink1URL: https://datasheet.ciiva.com/25782/cl05c200jb5nnnc-25782785.pdf?src-supplier=Digi-Key; ComponentLink1Description: https://datasheet.ciiva.com/25782/cl05c200jb5nnnc-25782785.pdf?src-supplier=Digi-Key; ComponentLink2URL: https://datasheet.ciiva.com/16428/cl05c200jb5nnnc-16428806.pdf?src-supplier=Future+Electronics; ComponentLink2Description: https://datasheet.ciiva.com/16428/cl05c200jb5nnnc-16428806.pdf?src-supplier=Future+Electronics; ComponentLink3URL: https://datasheet.ciiva.com/26838/getdatasheetpartid-729190-26838291.pdf?src-supplier=Verical; ComponentLink3Description: https://datasheet.ciiva.com/26838/getdatasheetpartid-729190-26838291.pdf?src-supplier=Verical; Supplier Part Number 1: 1276-1661-1-ND
C26 = CAP CER 10nF 50V 5% X7R 0603: 10000pF ±5% 50V Ceramic Capacitor U2J 0603 (1608 Metric); Manufacturer 1: KEMET; Manufacturer Part Number 1: C0603C103J5JAC7867; Supplier 1: Digi-Key; Supplier Part Number 1: 399-13384-1-ND; Packaging: Cut Tape (CT); Part Status: Active; Operating Temperature: -55°C ~ 125°C; Ratings: -; Failure Rate: -; Mounting Type: Surface Mount, MLCC; Package / Case: 0603 (1608 Metric); Size / Dimension: 0.063" L x 0.032" W (1.60mm x 0.80mm); Height - Seated (Max): -; Thickness (Max): 0.034" (0.87mm); Lead Spacing: -; Lead Style: -; ComponentLink1URL: http://www.kemet.com/docfinder?Partnumber=C0603C103J5JAC7867; ComponentLink1Description: http://www.kemet.com/docfinder?Partnumber=C0603C103J5JAC7867; Tolerance: ±5%
D2 = DIODE TVS 5.25V 17V SOT23-6: 17V Clamp 5A (8/20µs) Ipp Tvs Diode Surface Mount SOT-23-6; Manufacturer 1: STMicroelectronics; Data Rate: 480Mbps; Direction: Unidirectional; Capacitance: 3.5pF; Operating Supply Voltage: 1.1V; Number of Elements: 1; Number of Channels: 2; Reverse Breakdown Voltage: 6V; Working Voltage: 5V; Power Line Protection: Yes; Test Current: 1mA; Max Reverse Leakage Current: 150nA; Element Configuration: Dual; Supplier 1: Digi-Key; Stock 1: 7579; Pricing 1: 1=0.47000, 10=0.39900, 100=0.29820, 500=0.23430, 1000=0.18105 (USD); RoHS: Yes; Mount: Surface Mount; Case/Package: SOT-23; Number of Pins: 6; Contact Plating: Tin; Min Operating Temperature: -40°C; Max Operating Temperature: 125°C; Packaging: Tape and Reel; Package Quantity: 3000; Polarity: Unidirectional; Breakdown Voltage: 6V; Clamping Voltage: 17V; Termination: SMD/SMT; Number of Bidirectional Channels: 2; Reverse Standoff Voltage: 5.25V; Min Breakdown Voltage: 6V; ESD Protection: Yes; Max Breakdown Voltage: 6V; Leakage Current: 150nA; Peak Pulse Current: 5A; Length: 3.05mm; Height: 1.3mm; Width: 1.75mm; Depth: 1.75mm; Radiation Hardening: No; REACH SVHC: No SVHC; Lead Free: Lead Free; ComponentLink1URL: https://datasheet.ciiva.com/1268/1690354-1268384.pdf?src-supplier=Element14; ComponentLink1Description: https://datasheet.ciiva.com/1268/1690354-1268384.pdf?src-supplier=Element14; ComponentLink2URL: https://datasheet.ciiva.com/4508/cd00050750-113117-4508433.pdf?src-supplier=Mouser; ComponentLink2Description: https://datasheet.ciiva.com/4508/cd00050750-113117-4508433.pdf?src-supplier=Mouser; ComponentLink3URL: https://datasheet.ciiva.com/15143/getdatasheetpartid-148465-15143789.pdf?src-supplier=Verical; ComponentLink3Description: https://datasheet.ciiva.com/15143/getdatasheetpartid-148465-15143789.pdf?src-supplier=Verical; ComponentLink4URL: https://datasheet.ciiva.com/26787/usblc6-2sc6-26787908.pdf?src-supplier=IIIC; ComponentLink4Description: https://datasheet.ciiva.com/26787/usblc6-2sc6-26787908.pdf?src-supplier=IIIC; ComponentLink5URL: https://datasheet.ciiva.com/16200/cd00050750-16200026.pdf?src-supplier=Future+Electronics; ComponentLink5Description: https://datasheet.ciiva.com/16200/cd00050750-16200026.pdf?src-supplier=Future+Electronics; ComponentLink6URL: https://datasheet.ciiva.com/41444/001184109-da-01-en-ic-esd-protecti-usblc6-2sc6-sot-23-6-stm-41444156.pdf?src-supplier=Conrad; ComponentLink6Description: https://datasheet.ciiva.com/41444/001184109-da-01-en-ic-esd-protecti-usblc6-2sc6-sot-23-6-stm-41444156.pdf?src-supplier=Conrad; Supplier Part Number 1: 497-5235-1-ND
F1 = FUSE 375MA 125VDC 1206: FUSE BOARD MNT 375MA 125VAC/VDC; Manufacturer: Littelfuse; Body Material: Thermoplastic; Voltage Rating (DC): 125V; Resistance: 690mR; DC Cold Resistance: 350mR; Fuse Type: Board Mount (Cartridge Style Excluded); Approvals: CSA,UL; Supplier 1: Digi-Key; Stock 1: 22359; Pricing 1: 1=0.84, 5=0.812, 10=0.787, 50=0.6618, 100=0.5493, 250=0.4994, 500=0.4245, 1000=0.37455 (USD); Mount: Surface Mount; Case/Package: 1206; Number of Pins: 2; Case Code (Metric): 3216; Case Code (Imperial): 1206; Housing Material: Ceramic; Terminal Material: Copper; Min Operating Temperature: -55°C; Max Operating Temperature: 90°C; Packaging: Tape and Reel; Package Quantity: 5000; Voltage Rating: 125V; Termination: SMD/SMT; Voltage Rating (AC): 125V; Fuse Current: 375mA; Working Voltage: 125V; Length: 3.18mm; Height: 0.023inch; Width: 0.06inch; Depth: 1.52mm; Radiation Hardening: No; REACH SVHC: Unknown; Lead Free: Lead Free; ComponentLink1URL: http://www.littelfuse.com/data/en/Data_Sheets/Littelfuse_Fuse_466.pdf; ComponentLink1Description: http://www.littelfuse.com/data/en/Data_Sheets/Littelfuse_Fuse_466.pdf; ComponentLink2URL: http://www.littelfuse.com/~/media/electronics/datasheets/fuses/littelfuse_fuse_466_datasheet.pdf.pdf; ComponentLink2Description: http://www.littelfuse.com/~/media/electronics/datasheets/fuses/littelfuse_fuse_466_datasheet.pdf.pdf; ComponentLink3URL: //media.digikey.com/pdf/Data%20Sheets/Littelfuse%20PDFs/466%20Series%20Drawing.pdf; ComponentLink3Description: //media.digikey.com/pdf/Data%20Sheets/Littelfuse%20PDFs/466%20Series%20Drawing.pdf; ComponentLink4URL: http://www.farnell.com/datasheets/48294.pdf; ComponentLink4Description: http://www.farnell.com/datasheets/48294.pdf; ComponentLink5URL: https://www.verical.com/server-webapp/html/getDatasheet?partID=134212; ComponentLink5Description: https://www.verical.com/server-webapp/html/getDatasheet?partID=134212; Supplier Part Number 1: F1453CT-ND
LED2 = LED GREEN CLEAR 2V 0603: Green 572nm LED Indication - Discrete 2V 0603 (1608 Metric); Manufacturer: Wurth Electronics Inc.; Manufacturer Part Number: 150060VS75000; Lens Color: Colorless; Millicandela Rating: 40mcd; Lens Style/Size: Rectangle with Flat Top, 1.10mm x 0.70mm; Current - Test: 20mA; Viewing Angle: 140°; Wavelength - Dominant: 570nm; Supplier 1: Digi-Key; RoHS: RoHS Compliant; Category: Optoelectronics; Stock 1: 9408; Pricing 1: 1=0.21, 100=0.1617, 500=0.13964 (CAD); Packaging: Cut Tape (CT); Part Status: Active; Lens Transparency: Clear; Mounting Type: Surface Mount; Wavelength - Peak: 572nm; Features: -; Package / Case: 0603 (1608 Metric); Supplier Device Package: 0603; Size / Dimension: 1.60mm L x 0.80mm W; Height (Max): 0.80mm; ComponentLink1URL: http://katalog.we-online.de/led/datasheet/150060VS75000.pdf; ComponentLink1Description: http://katalog.we-online.de/led/datasheet/150060VS75000.pdf; Supplier Part Number 1: 732-4980-1-ND
P2 = CONN RECPT USB2.0 TYPE-C 16POS: USB - C USB 2.0 Receptacle Connector 16 Position Through Hole, Right Angle; Manufacturer: Global Connector Technology; Supplier 1: Digi-Key; Supplier Part Number 1: 2073-USB4085-GF-ACT-ND; Stock 1: 286; Pricing 1: 1 = 1.440000, 10 = 1.307000, 25 = 1.227200, 50 = 1.174000, 100 = 1.120600, 250 = 1.013840 (USD); RoHS: No
R33 R34 R37 R38 = RES 10K OHM 1% 1/16W 0402: Surface Mount Thick Film Resistor, Rc Series, 10 Kohm, 62.5 Mw, - 1%, 50 V, 0402 [1005 Metric]; Manufacturer: Yageo; Manufacturer Part Number: RC0402FR-0710KL; Temperature Coefficient: 100ppm/°C; Voltage Rating: 50V; Power Rating: 62.5mW; Supplier 1: Digi-Key; RoHS: Yes; Category: Chip SMD Resistors; Stock 1: 60761136; Pricing 1: 1=0.10000, 10=0.01600, 100=0.00640, 1000=0.00289, 2500=0.00251, 5000=0.00207 (USD); Case/Package: 0402; Number of Pins: 2; Case Code (Imperial): 0402; Case Code (Metric): 1005; Min Operating Temperature: -55°C; Max Operating Temperature: 155°C; Packaging: Tape and Reel; Composition: Thick Film; Voltage Rating (DC): 50V; Termination: SMD/SMT; Military Standard: Not; Working Voltage: 50V; Number of Terminations: 2; Length: 1mm; Height: 0.32mm; Width: 0.5mm; Depth: 0.5mm; Lead Pitch: 0.2mm; REACH SVHC: No SVHC; Lead Free: Lead Free; ComponentLink1URL: https://datasheet.ciiva.com/7660/38568-7660787.pdf?src-supplier=Element14; ComponentLink1Description: https://datasheet.ciiva.com/7660/38568-7660787.pdf?src-supplier=Element14; ComponentLink2URL: https://datasheet.ciiva.com/7983/1018594-7983486.pdf?src-supplier=Element14; ComponentLink2Description: https://datasheet.ciiva.com/7983/1018594-7983486.pdf?src-supplier=Element14; ComponentLink3URL: https://datasheet.ciiva.com/7849/1784430-7849813.pdf?src-supplier=Element14; ComponentLink3Description: https://datasheet.ciiva.com/7849/1784430-7849813.pdf?src-supplier=Element14; ComponentLink4URL: https://datasheet.ciiva.com/7849/1686128-7849814.pdf?src-supplier=Element14; ComponentLink4Description: https://datasheet.ciiva.com/7849/1686128-7849814.pdf?src-supplier=Element14; ComponentLink5URL: https://datasheet.ciiva.com/7849/1784430-7849815.pdf?src-supplier=Element14; ComponentLink5Description: https://datasheet.ciiva.com/7849/1784430-7849815.pdf?src-supplier=Element14; ComponentLink6URL: https://datasheet.ciiva.com/22747/1018594-22747512.pdf?src-supplier=Element14; ComponentLink6Description: https://datasheet.ciiva.com/22747/1018594-22747512.pdf?src-supplier=Element14; ComponentLink7URL: https://datasheet.ciiva.com/12667/pyu-rc0402-51-rohs-l-6-r-12667067.pdf?src-supplier=Mouser; ComponentLink7Description: https://datasheet.ciiva.com/12667/pyu-rc0402-51-rohs-l-6-r-12667067.pdf?src-supplier=Mouser; Supplier Part Number 1: 311-10.0KLRCT-ND
R35 = RES 47.5K OHM 1% 1/16W 0402: RES SMD 47.5K OHM 1% 1/16W 0402; Manufacturer: Yageo; Manufacturer Part Number: RC0402FR-0747K5L; Power Rating: 62.5mW; Voltage Rating: 50V; Temperature Coefficient: 100ppm/°C; Supplier 1: Digi-Key; RoHS: Yes; Category: Chip SMD Resistors; Stock 1: 1151028; Pricing 1: 1=0.10000, 10=0.01600, 100=0.00640, 1000=0.00289, 2500=0.00251, 5000=0.00207 (USD); Case/Package: 0402; Case Code (Imperial): 0402; Case Code (Metric): 1005; Min Operating Temperature: -55°C; Max Operating Temperature: 155°C; Packaging: Tape and Reel; Termination: SMD/SMT; Composition: Thick Film; Military Standard: Not; Voltage Rating (DC): 50V; Length: 1mm; Depth: 0.5mm; Lead Free: Lead Free; REACH SVHC: No SVHC; ComponentLink1URL: https://datasheet.ciiva.com/16746/pyu-rc0402-51-rohs-l-6-r-16746316.pdf?src-supplier=Future+Electronics; ComponentLink1Description: https://datasheet.ciiva.com/16746/pyu-rc0402-51-rohs-l-6-r-16746316.pdf?src-supplier=Future+Electronics; ComponentLink2URL: https://datasheet.ciiva.com/46394/1018594-46394942.pdf?src-supplier=Element14; ComponentLink2Description: https://datasheet.ciiva.com/46394/1018594-46394942.pdf?src-supplier=Element14; ComponentLink3URL: https://datasheet.ciiva.com/12667/pyu-rc0402-51-rohs-l-6-r-12667103.pdf?src-supplier=Mouser; ComponentLink3Description: https://datasheet.ciiva.com/12667/pyu-rc0402-51-rohs-l-6-r-12667103.pdf?src-supplier=Mouser; Supplier Part Number 1: 311-47.5KLRCT-ND
R36 = RES 649 OHM 1% 1/16W 0402: RES SMD 649 OHM 1% 1/16W 0402; Manufacturer: Stackpole Electronics; Manufacturer Part Number: RMCF0402FT649R; Max Power Dissipation: 63mW; Temperature Coefficient: 100ppm/°C; Supplier 1: Digi-Key; RoHS: Yes; Category: Chip SMD Resistors; Stock 1: 48315; Pricing 1: 1=0.10000, 10=0.01400, 100=0.00580, 1000=0.00262, 2500=0.00228, 5000=0.00188 (USD); Mount: Surface Mount; Case/Package: 0402; Case Code (Metric): 1005; Case Code (Imperial): 0402; Contact Plating: Tin,Matte; Min Operating Temperature: -55°C; Max Operating Temperature: 155°C; Packaging: Tape and Reel; Composition: Thick Film; Number of Terminations: 2; Features: Automotive AEC-Q200; Length: 0.039inch; Height: 0.016inch; Width: 0.02inch; Lead Free: Lead Free; ComponentLink1URL: https://www.seielect.com/catalog/SEI-Packaging.pdf?src-supplier=Digi-Key; ComponentLink1Description: https://www.seielect.com/catalog/SEI-Packaging.pdf?src-supplier=Digi-Key; ComponentLink2URL: https://www.seielect.com/Catalog/SEI-RMCF_RMCP.pdf?src-supplier=Avnet; ComponentLink2Description: https://www.seielect.com/Catalog/SEI-RMCF_RMCP.pdf?src-supplier=Avnet; ComponentLink3URL: https://www.seielect.com/Catalog/SEI-RMCF_RMCP.pdf?src-supplier=Digi-Key; ComponentLink3Description: https://www.seielect.com/Catalog/SEI-RMCF_RMCP.pdf?src-supplier=Digi-Key; Supplier Part Number 1: RMCF0402FT649RCT-ND
U7 = IC USB 2.0 HUB CONTROLLER 28QFN: USB Hub Controller USB 2.0 USB Interface 28-QFN (5x5); Manufacturer: Cypress; Data Rate: 480Mbps; Interface: I2C,SPI,GPIO; Max Supply Voltage: 5.25V; Min Supply Voltage: 3.15V; Operating Supply Current: 97.23mA; Operating Supply Voltage: 3.45V; Supplier 1: Digi-Key; RoHS: Yes; Category: Interface ICs; Stock 1: 14139; Pricing 1: 1=3.33000, 10=2.99500, 25=2.83160, 100=2.32800, 250=2.08896, 500=2.01344, 1000=1.67367 (USD); Case/Package: QFN; Number of Pins: 28; Min Operating Temperature: 0°C; Max Operating Temperature: 70°C; Package Quantity: 1; Packaging: Tape and Reel; Lead Free: Lead Free; ComponentLink1URL: https://datasheet.ciiva.com/6636/cy7c65632-34-6636581.pdf?src-supplier=Digi-Key; ComponentLink1Description: https://datasheet.ciiva.com/6636/cy7c65632-34-6636581.pdf?src-supplier=Digi-Key; ComponentLink2URL: https://datasheet.ciiva.com/6636/cy7c65632-34-6636584.pdf?src-supplier=Digi-Key; ComponentLink2Description: https://datasheet.ciiva.com/6636/cy7c65632-34-6636584.pdf?src-supplier=Digi-Key; Supplier Part Number 1: 428-3156-1-ND
Y1 = CRYSTAL 12 MHz 12PF SMD: 12MHz ±25ppm Crystal 12pF 100 Ohms 4-SMD, No Lead; Manufacturer: ECS International; Manufacturer Part Number: ECS-120-12-33-AEN-TR; Supplier 1: Digi-Key; RoHS: No; Stock 1: 2000; Pricing 1: 1=0.56000, 10=0.46800, 50=0.42080, 100=0.37400, 500=0.35530 (USD)